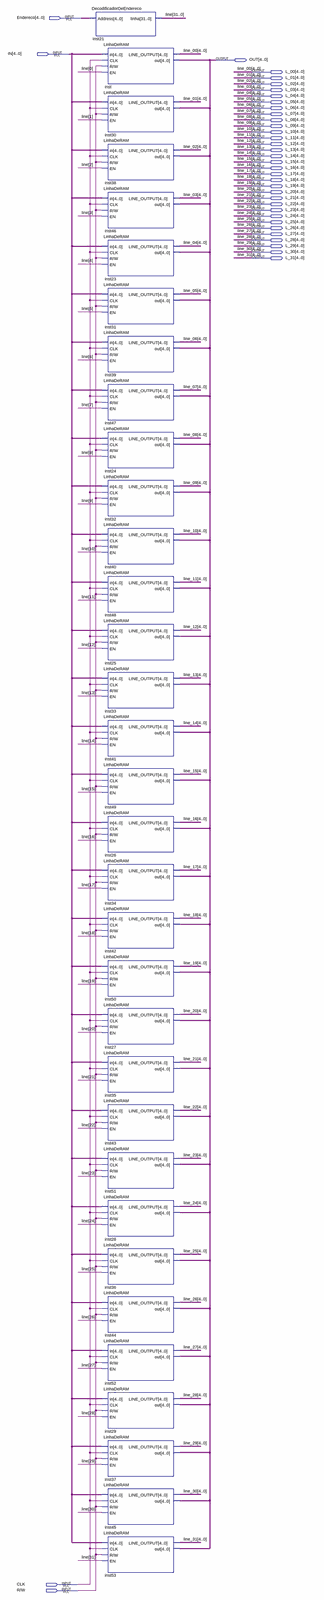
[diagram p0: schematic sheet, whole]
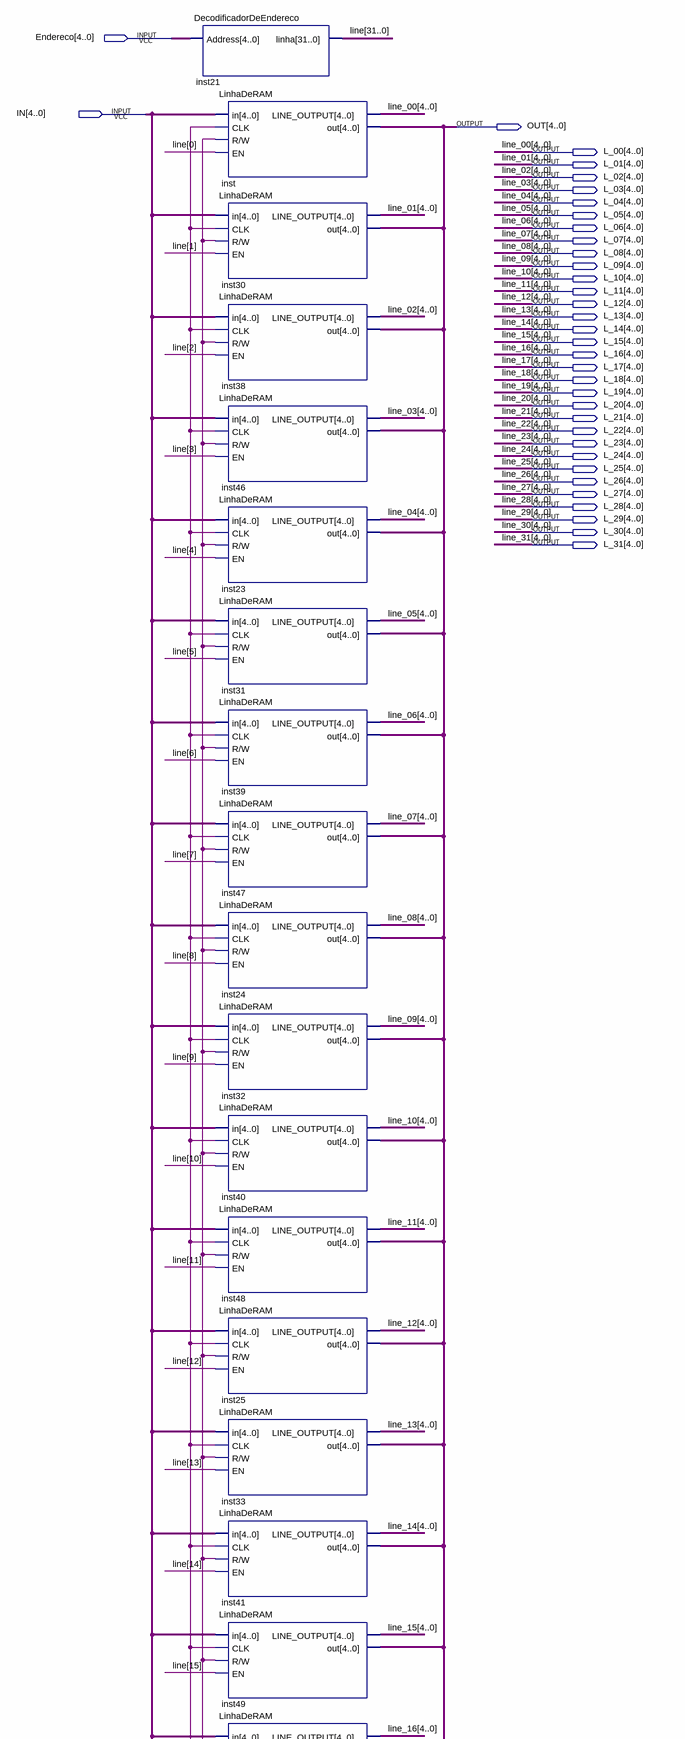
[diagram p1: schematic sheet, upper part]
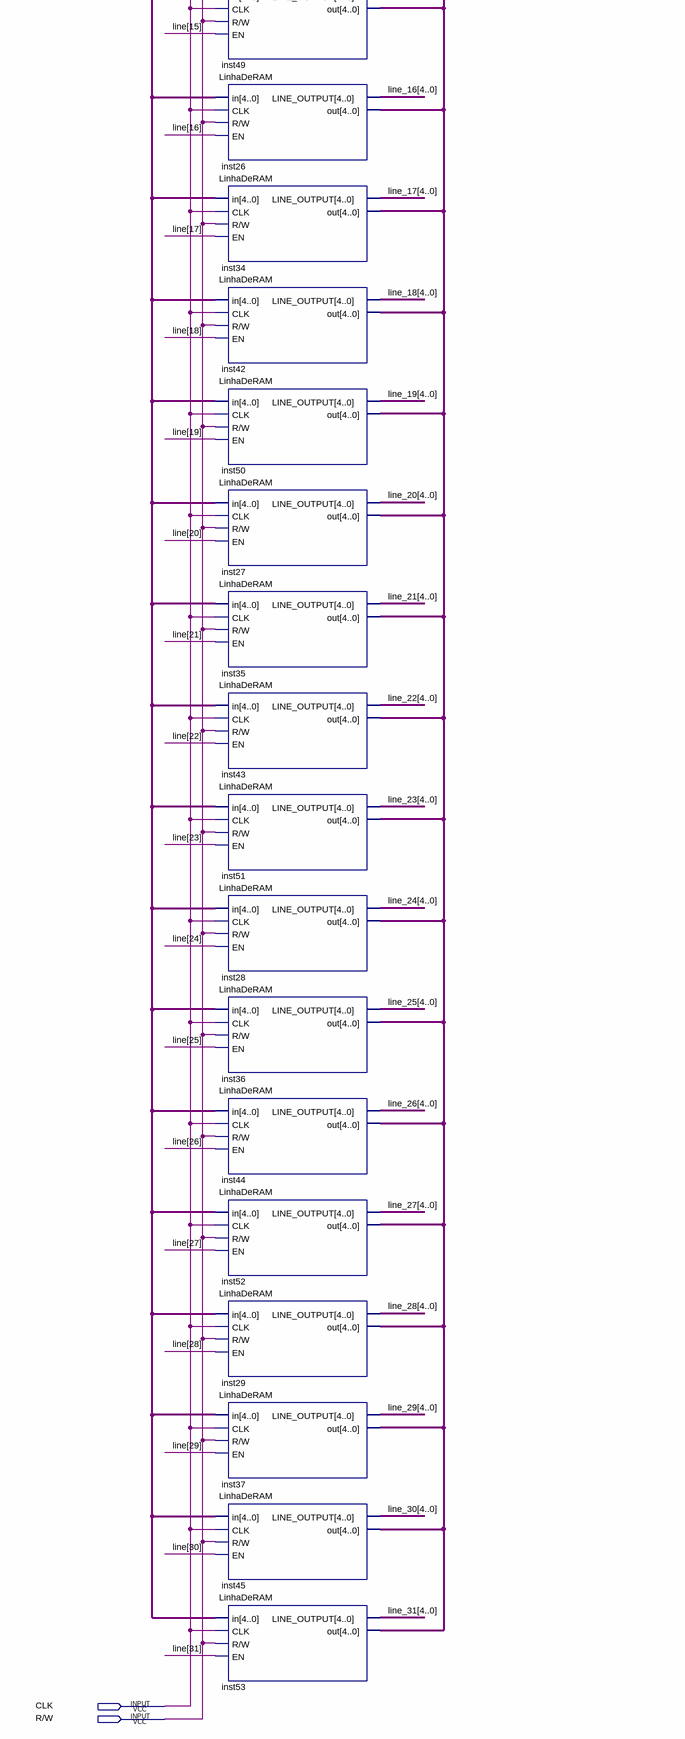
[diagram p2: schematic sheet, lower part]
// Quartus schematic MemoriaRAM.bdf as structural Verilog: 33 symbols, 37 pins
module MemoriaRAM (
  input  [4:0] Endereco,
  input  [4:0] IN,
  input  CLK,
  input  \R/W ,
  output [4:0] OUT,
  output [4:0] L_00,
  output [4:0] L_01,
  output [4:0] L_02,
  output [4:0] L_03,
  output [4:0] L_04,
  output [4:0] L_05,
  output [4:0] L_06,
  output [4:0] L_07,
  output [4:0] L_08,
  output [4:0] L_09,
  output [4:0] L_10,
  output [4:0] L_11,
  output [4:0] L_12,
  output [4:0] L_13,
  output [4:0] L_14,
  output [4:0] L_15,
  output [4:0] L_16,
  output [4:0] L_17,
  output [4:0] L_18,
  output [4:0] L_19,
  output [4:0] L_20,
  output [4:0] L_21,
  output [4:0] L_22,
  output [4:0] L_23,
  output [4:0] L_24,
  output [4:0] L_25,
  output [4:0] L_26,
  output [4:0] L_27,
  output [4:0] L_28,
  output [4:0] L_29,
  output [4:0] L_30,
  output [4:0] L_31
);

  wire [31:0] line;

  DecodificadorDeEndereco inst21 (.Address(Endereco), .linha(line));
  LinhaDeRAM inst (.in(IN), .CLK(CLK), .\R/W (\R/W ), .EN(line[0]), .LINE_OUTPUT(L_00), .out(OUT));
  LinhaDeRAM inst30 (.in(IN), .CLK(CLK), .\R/W (\R/W ), .EN(line[1]), .LINE_OUTPUT(L_01), .out(OUT));
  LinhaDeRAM inst38 (.in(IN), .CLK(CLK), .\R/W (\R/W ), .EN(line[2]), .LINE_OUTPUT(L_02), .out(OUT));
  LinhaDeRAM inst46 (.in(IN), .CLK(CLK), .\R/W (\R/W ), .EN(line[3]), .LINE_OUTPUT(L_03), .out(OUT));
  LinhaDeRAM inst23 (.in(IN), .CLK(CLK), .\R/W (\R/W ), .EN(line[4]), .LINE_OUTPUT(L_04), .out(OUT));
  LinhaDeRAM inst31 (.in(IN), .CLK(CLK), .\R/W (\R/W ), .EN(line[5]), .LINE_OUTPUT(L_05), .out(OUT));
  LinhaDeRAM inst39 (.in(IN), .CLK(CLK), .\R/W (\R/W ), .EN(line[6]), .LINE_OUTPUT(L_06), .out(OUT));
  LinhaDeRAM inst47 (.in(IN), .CLK(CLK), .\R/W (\R/W ), .EN(line[7]), .LINE_OUTPUT(L_07), .out(OUT));
  LinhaDeRAM inst24 (.in(IN), .CLK(CLK), .\R/W (\R/W ), .EN(line[8]), .LINE_OUTPUT(L_08), .out(OUT));
  LinhaDeRAM inst32 (.in(IN), .CLK(CLK), .\R/W (\R/W ), .EN(line[9]), .LINE_OUTPUT(L_09), .out(OUT));
  LinhaDeRAM inst40 (.in(IN), .CLK(CLK), .\R/W (\R/W ), .EN(line[10]), .LINE_OUTPUT(L_10), .out(OUT));
  LinhaDeRAM inst48 (.in(IN), .CLK(CLK), .\R/W (\R/W ), .EN(line[11]), .LINE_OUTPUT(L_11), .out(OUT));
  LinhaDeRAM inst25 (.in(IN), .CLK(CLK), .\R/W (\R/W ), .EN(line[12]), .LINE_OUTPUT(L_12), .out(OUT));
  LinhaDeRAM inst33 (.in(IN), .CLK(CLK), .\R/W (\R/W ), .EN(line[13]), .LINE_OUTPUT(L_13), .out(OUT));
  LinhaDeRAM inst41 (.in(IN), .CLK(CLK), .\R/W (\R/W ), .EN(line[14]), .LINE_OUTPUT(L_14), .out(OUT));
  LinhaDeRAM inst49 (.in(IN), .CLK(CLK), .\R/W (\R/W ), .EN(line[15]), .LINE_OUTPUT(L_15), .out(OUT));
  LinhaDeRAM inst26 (.in(IN), .CLK(CLK), .\R/W (\R/W ), .EN(line[16]), .LINE_OUTPUT(L_16), .out(OUT));
  LinhaDeRAM inst34 (.in(IN), .CLK(CLK), .\R/W (\R/W ), .EN(line[17]), .LINE_OUTPUT(L_17), .out(OUT));
  LinhaDeRAM inst42 (.in(IN), .CLK(CLK), .\R/W (\R/W ), .EN(line[18]), .LINE_OUTPUT(L_18), .out(OUT));
  LinhaDeRAM inst50 (.in(IN), .CLK(CLK), .\R/W (\R/W ), .EN(line[19]), .LINE_OUTPUT(L_19), .out(OUT));
  LinhaDeRAM inst27 (.in(IN), .CLK(CLK), .\R/W (\R/W ), .EN(line[20]), .LINE_OUTPUT(L_20), .out(OUT));
  LinhaDeRAM inst35 (.in(IN), .CLK(CLK), .\R/W (\R/W ), .EN(line[21]), .LINE_OUTPUT(L_21), .out(OUT));
  LinhaDeRAM inst43 (.in(IN), .CLK(CLK), .\R/W (\R/W ), .EN(line[22]), .LINE_OUTPUT(L_22), .out(OUT));
  LinhaDeRAM inst51 (.in(IN), .CLK(CLK), .\R/W (\R/W ), .EN(line[23]), .LINE_OUTPUT(L_23), .out(OUT));
  LinhaDeRAM inst28 (.in(IN), .CLK(CLK), .\R/W (\R/W ), .EN(line[24]), .LINE_OUTPUT(L_24), .out(OUT));
  LinhaDeRAM inst36 (.in(IN), .CLK(CLK), .\R/W (\R/W ), .EN(line[25]), .LINE_OUTPUT(L_25), .out(OUT));
  LinhaDeRAM inst44 (.in(IN), .CLK(CLK), .\R/W (\R/W ), .EN(line[26]), .LINE_OUTPUT(L_26), .out(OUT));
  LinhaDeRAM inst52 (.in(IN), .CLK(CLK), .\R/W (\R/W ), .EN(line[27]), .LINE_OUTPUT(L_27), .out(OUT));
  LinhaDeRAM inst29 (.in(IN), .CLK(CLK), .\R/W (\R/W ), .EN(line[28]), .LINE_OUTPUT(L_28), .out(OUT));
  LinhaDeRAM inst37 (.in(IN), .CLK(CLK), .\R/W (\R/W ), .EN(line[29]), .LINE_OUTPUT(L_29), .out(OUT));
  LinhaDeRAM inst45 (.in(IN), .CLK(CLK), .\R/W (\R/W ), .EN(line[30]), .LINE_OUTPUT(L_30), .out(OUT));
  LinhaDeRAM inst53 (.in(IN), .CLK(CLK), .\R/W (\R/W ), .EN(line[31]), .LINE_OUTPUT(L_31), .out(OUT));

  // Other names for the same wires on the sheet: line_00[4:0] = L_00; line_01[4:0] = L_01; line_02[4:0] = L_02;
  //   line_03[4:0] = L_03; line_04[4:0] = L_04; line_05[4:0] = L_05; line_06[4:0] = L_06; line_07[4:0] = L_07;
  //   line_08[4:0] = L_08; line_09[4:0] = L_09; line_10[4:0] = L_10; line_11[4:0] = L_11; line_12[4:0] = L_12;
  //   line_13[4:0] = L_13; line_14[4:0] = L_14; line_15[4:0] = L_15; line_16[4:0] = L_16; line_17[4:0] = L_17;
  //   line_18[4:0] = L_18; line_19[4:0] = L_19; line_20[4:0] = L_20; line_21[4:0] = L_21; line_22[4:0] = L_22;
  //   line_23[4:0] = L_23; line_24[4:0] = L_24; line_25[4:0] = L_25; line_26[4:0] = L_26; line_27[4:0] = L_27;
  //   line_28[4:0] = L_28; line_29[4:0] = L_29; line_30[4:0] = L_30; line_31[4:0] = L_31
endmodule
